# Altium schematic sheet COVER PAGE.SchDoc: NEMA PANDORA V2
size A4; DrawnBy: Nhatkhongbuon; SheetNumber: 1; SheetTotal: 5
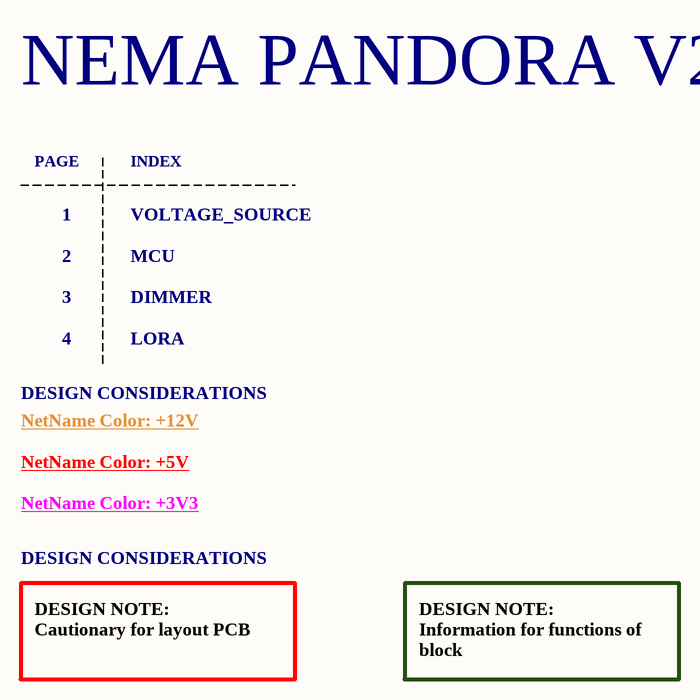
[diagram p0: COVER PAGE.SchDoc]

## Notes on the sheet
- NEMA PANDORA V2
- PAGE
- INDEX
- 1
- VOLTAGE_SOURCE
- 2
- 3
- MCU
- DIMMER
- 4
- LORA
- DESIGN CONSIDERATIONS
- NetName Color: +12V
- NetName Color: +5V
- NetName Color: +3V3
- DESIGN NOTE:
  Cautionary for layout PCB
- DESIGN NOTE:
  Information for functions of block